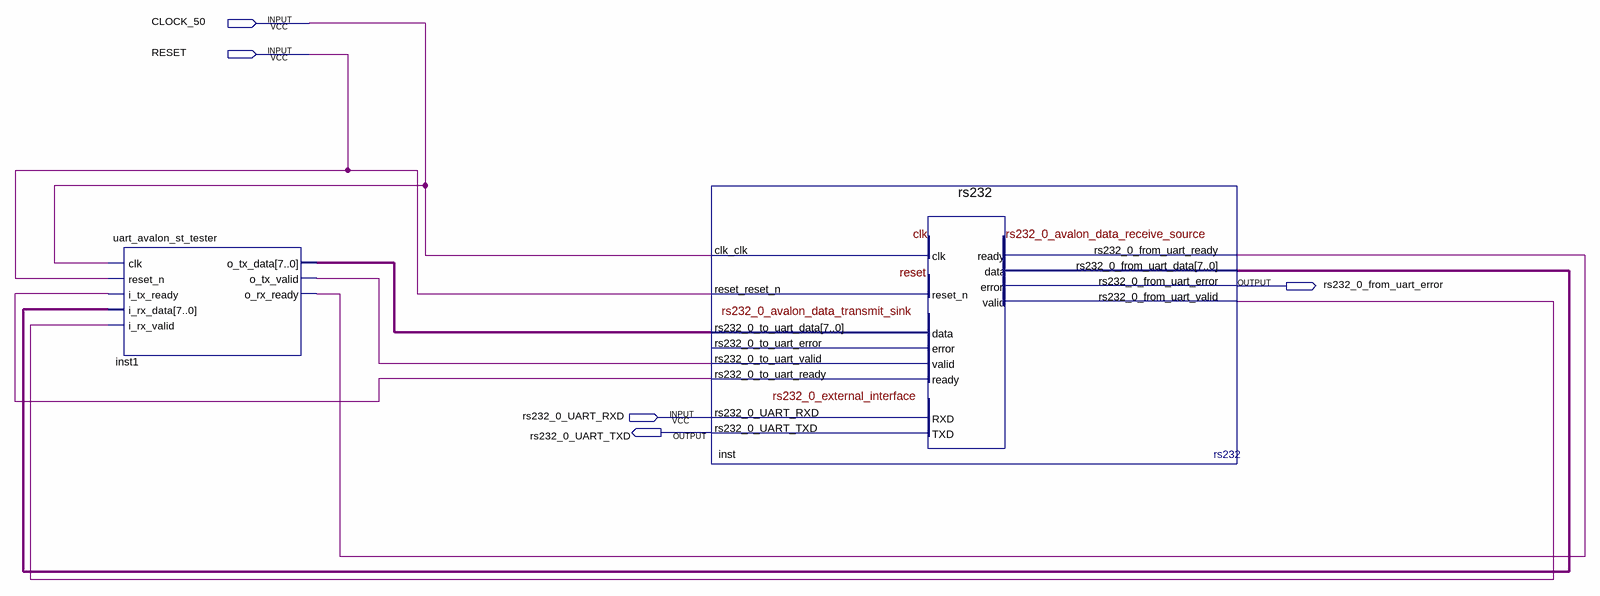
[diagram p0: schematic sheet]
// Quartus schematic communicator.bdf as structural Verilog: 2 symbols, 5 pins
module communicator (
  input  CLOCK_50,
  input  RESET,
  input  rs232_0_UART_RXD,
  output rs232_0_from_uart_error,
  output rs232_0_UART_TXD
);

  wire inst1_o_rx_ready, inst1_o_tx_valid, inst_rs232_0_from_uart_valid, inst_rs232_0_to_uart_ready;
  wire [7:0] inst1_o_tx_data, inst_rs232_0_from_uart_data;

  uart_avalon_st_tester inst1 (
    .clk(CLOCK_50), .reset_n(RESET), .i_tx_ready(inst_rs232_0_to_uart_ready),
    .i_rx_data(inst_rs232_0_from_uart_data), .i_rx_valid(inst_rs232_0_from_uart_valid),
    .o_tx_data(inst1_o_tx_data), .o_tx_valid(inst1_o_tx_valid), .o_rx_ready(inst1_o_rx_ready));
  rs232 inst (
    .clk_clk(CLOCK_50), .reset_reset_n(RESET), .rs232_0_from_uart_ready(inst1_o_rx_ready),
    .rs232_0_to_uart_data(inst1_o_tx_data), .rs232_0_to_uart_valid(inst1_o_tx_valid),
    .rs232_0_UART_RXD(rs232_0_UART_RXD), .rs232_0_from_uart_data(inst_rs232_0_from_uart_data),
    .rs232_0_from_uart_error(rs232_0_from_uart_error),
    .rs232_0_from_uart_valid(inst_rs232_0_from_uart_valid),
    .rs232_0_to_uart_ready(inst_rs232_0_to_uart_ready), .rs232_0_UART_TXD(rs232_0_UART_TXD));  // open: rs232_0_to_uart_error
endmodule
